# Altium schematic sheet USB.SchDoc: USB
size 279 x 215 mm; Engineer: Prasoon Sinha; DocumentNumber: 8; SheetNumber: 8; SheetTotal: 26
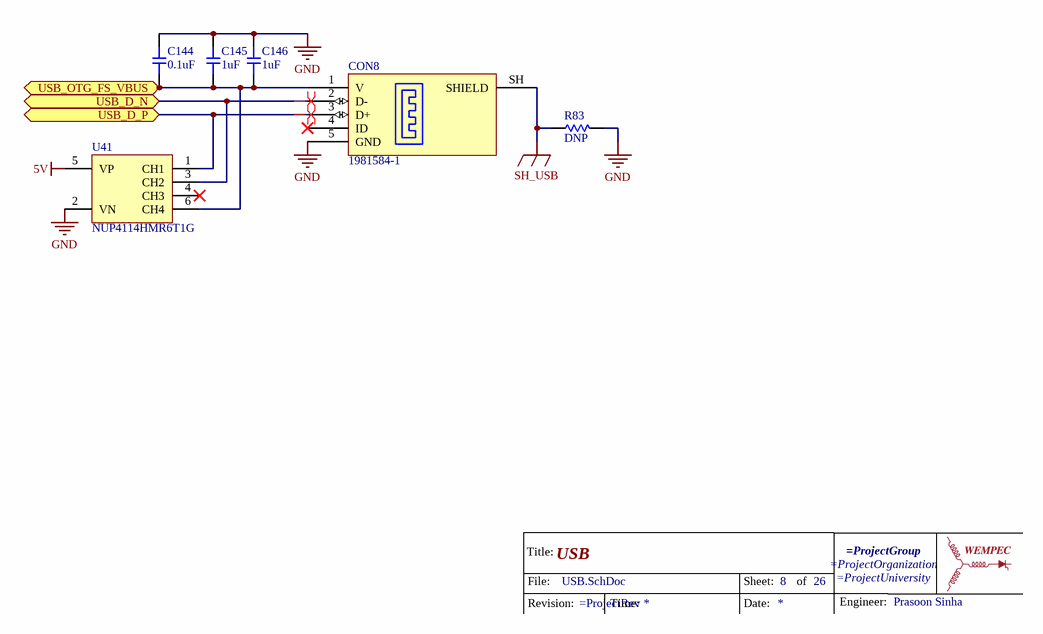
[diagram p0: USB.SchDoc]

## Parts
*?  TitleBlockWEMPEC  (value not drawn)  (graphical)
C144  value 0.1uF  [0603-CAP]  (hidden comment: Capacitor)
C145  value 1uF  [0603-CAP]  (hidden comment: Capacitor)
C146  value 1uF  [0603-CAP]  (hidden comment: Capacitor)
CON8  1981584-1  [1981584-1]
R83  value DNP  [0603-RES]  (hidden comment: Resistor)
U41  NUP4114HMR6T1G  [TSOP95P280X110-6N]

## Ports
USB_D_N (bidir), USB_D_P (bidir), USB_OTG_FS_VBUS (bidir)

## Nets
5V: U41.5(VP)
GND: C144.2 C145.2 C146.2 CON8.5(GND) R83.2 U41.2(VN)
SH_USB: CON8.SH(SHIELD) R83.1
USB_D_N: CON8.2(D-) U41.3(CH2) ; port USB_D_N
USB_D_P: CON8.3(D+) U41.1(CH1) ; port USB_D_P
USB_OTG_FS_VBUS: C144.1 C145.1 C146.1 CON8.1(V) U41.6(CH4) ; port USB_OTG_FS_VBUS

Not connected (* = marked no-connect by the designer): CON8 4(ID)*; U41 4(CH3)*

## Layout directives
differential pair: USB_D_N, USB_D_P

## Notes on the sheet
- (in symbol TitleBlockWEMPEC) Title:; File:; Sheet:; of; Engineer:; Revision:; Time:; Date:

## Library data of the parts
CON8 = 1981584-1: CONN RCPT MICRO USB TYPE AB; Supplier 1: Digi-Key; Supplier Part Number 1: A97799TR-ND
U41 = NUP4114HMR6T1G: TVS DIODE 5.5V 10V 6TSOP; Supplier 1: Digi-Key; Supplier Part Number 1: NUP4114HMR6T1GOSCT-ND
C144-C146 = Capacitor: Supplier 1: Digi-Key
  C144: Supplier Part Number 1: 1276-1012-1-ND
  C145 C146: Supplier Part Number 1: 1276-6524-1-ND
R83 = Resistor: Supplier 1: Digi-Key; Supplier Part Number 1: P0.0GCT-ND